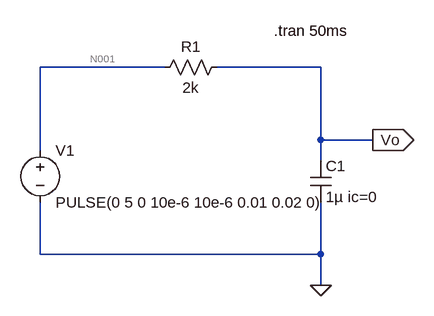
[diagram p0: schematic Ej 7 simulacion rc-pulse.asc]
Ej 7 simulacion rc-pulse.asc, the LTspice schematic file:
Version 4
SHEET 1 880 680
WIRE 208 64 16 64
WIRE 448 64 288 64
WIRE 448 176 448 64
WIRE 528 176 448 176
WIRE 16 192 16 64
WIRE 448 208 448 176
WIRE 16 352 16 272
WIRE 448 352 448 272
WIRE 448 352 16 352
WIRE 448 400 448 352
FLAG 448 400 0
FLAG 528 176 Vo
IOPIN 528 176 Out
SYMBOL voltage 16 176 R0
WINDOW 123 0 0 Left 0
WINDOW 39 0 0 Left 0
SYMATTR InstName V1
SYMATTR Value PULSE(0 5 0 10e-6 10e-6 0.01 0.02 0)
SYMBOL res 304 48 R90
WINDOW 0 0 56 VBottom 2
WINDOW 3 32 56 VTop 2
SYMATTR InstName R1
SYMATTR Value 2k
SYMBOL cap 432 208 R0
SYMATTR InstName C1
SYMATTR Value 1µ ic=0
TEXT 376 8 Left 2 !.tran 50ms

The netlist it stands for:
* Ej 7 simulacion rc-pulse.asc
V1 N001 0 PULSE(0 5 0 10e-6 10e-6 0.01 0.02 0)
R1 Vo N001 2k
C1 Vo 0 1µ ic=0
.tran 50ms
.backanno
.end

* Results of the author's LTspice run, read from the files saved beside the schematic
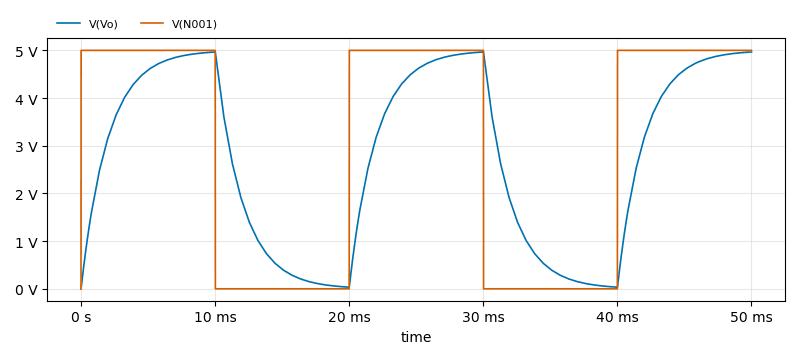
[diagram p1: Transient Analysis of Ej 7 simulacion rc-pulse.asc, plotted from the saved traces]
* Transient Analysis, 1 run:
*   V(Vo): min 0 V, max 4.967 V, average 2.803 V, rms 3.402 V, last 4.966 V
*   V(N001): min 0 V, max 5 V, average 3.002 V, rms 3.874 V, last 5 V